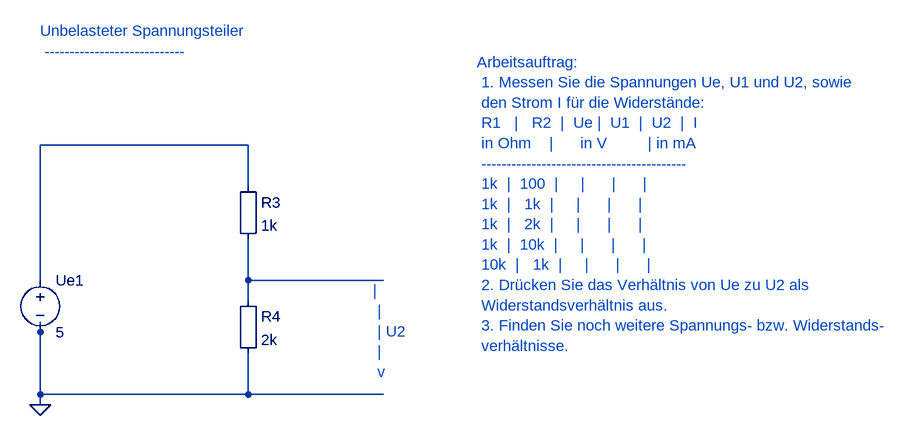
[diagram p0: schematic 1_2_1_unbelasteter_Spannungsteiler.asc]
1_2_1_unbelasteter_Spannungsteiler.asc, the LTspice schematic file:
Version 4
SHEET 1 880 680
WIRE 160 512 160 496
WIRE 160 432 160 224
WIRE 160 224 480 224
WIRE 480 224 480 288
WIRE 160 496 160 608
WIRE 480 368 480 432
WIRE 480 544 480 608
WIRE 160 608 160 624
WIRE 480 432 480 464
WIRE 688 432 480 432
WIRE 480 608 160 608
WIRE 688 608 480 608
FLAG 160 624 0
SYMBOL Misc\EuropeanResistor 464 272 R0
SYMATTR InstName R3
SYMATTR Value 1k
SYMBOL voltage 160 416 R0
SYMATTR InstName Ue1
SYMATTR Value 5
SYMBOL Misc\EuropeanResistor 464 448 R0
SYMATTR InstName R4
SYMATTR Value 2k
TEXT 160 48 Left 2 ;Unbelasteter Spannungsteiler \n ----------------------------
TEXT 672 448 Left 2 ;| \n | \n | U2 \n | \n v
TEXT 832 96 Left 2 ;Arbeitsauftrag: \n 1. Messen Sie die Spannungen Ue, U1 und U2, sowie \n den Strom I für die Widerstände: \n R1   |   R2  |  Ue |  U1  |  U2  |  I \n in Ohm    |      in V         | in mA \n ----------------------------------------- \n 1k  |  100  |     |      |      | \n 1k  |   1k  |     |      |      | \n 1k  |   2k  |     |      |      | \n 1k  |  10k  |     |      |      | \n 10k  |   1k  |     |      |      | \n 2. Drücken Sie das Verhältnis von Ue zu U2 als \n Widerstandsverhältnis aus. \n 3. Finden Sie noch weitere Spannungs- bzw. Widerstands- \n verhältnisse.

The netlist it stands for:
* 1_2_1_unbelasteter_Spannungsteiler.asc
R3 N001 N002 1k
V§Ue1 N001 0 5
R4 N002 0 2k
* Unbelasteter Spannungsteiler
*  ----------------------------
* |
*  |
*  | U2
*  |
*  v
* Arbeitsauftrag:
*  1. Messen Sie die Spannungen Ue, U1 und U2, sowie
*  den Strom I für die Widerstände:
*  R1   |   R2  |  Ue |  U1  |  U2  |  I
*  in Ohm    |      in V         | in mA
*  -----------------------------------------
*  1k  |  100  |     |      |      |
*  1k  |   1k  |     |      |      |
*  1k  |   2k  |     |      |      |
*  1k  |  10k  |     |      |      |
*  10k  |   1k  |     |      |      |
*  2. Drücken Sie das Verhältnis von Ue zu U2 als
*  Widerstandsverhältnis aus.
*  3. Finden Sie noch weitere Spannungs- bzw. Widerstands-
*  verhältnisse.
.backanno
.end